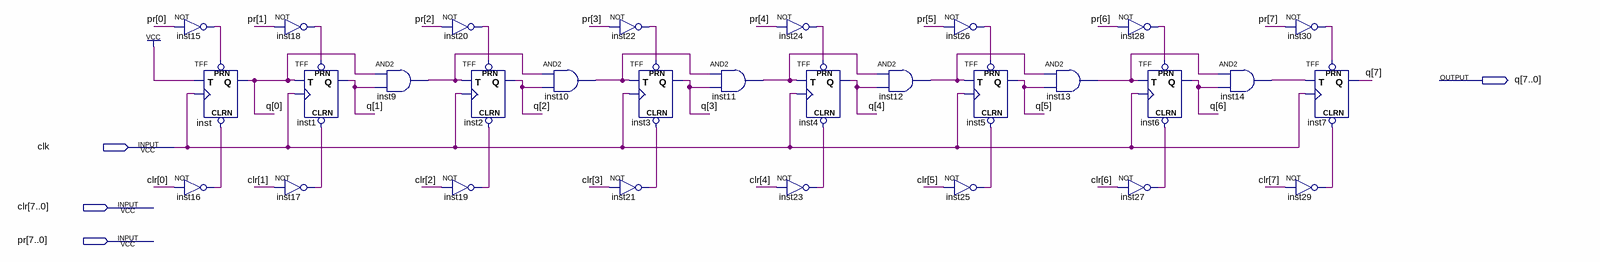
[diagram p0: schematic sheet]
// Quartus schematic contador.bdf as structural Verilog: 30 symbols, 4 pins
module contador (
  input  clk,
  input  [7:0] clr,
  input  [7:0] pr,
  output [7:0] q
);

  wire inst9_out, inst10_out, inst11_out, inst12_out, inst13_out, inst14_out, inst15_out, inst16_out,
       inst17_out, inst18_out, inst19_out, inst20_out, inst21_out, inst22_out, inst23_out, inst24_out,
       inst25_out, inst26_out, inst27_out, inst28_out, inst29_out, inst30_out;

  not inst15 (inst15_out, pr[0]);
  not inst16 (inst16_out, clr[0]);
  TFF inst (.PRN(inst15_out), .CLRN(inst16_out), .T(1'b1), .CLK(clk), .Q(q[0]));
  not inst18 (inst18_out, pr[1]);
  not inst17 (inst17_out, clr[1]);
  TFF inst1 (.PRN(inst18_out), .CLRN(inst17_out), .T(q[0]), .CLK(clk), .Q(q[1]));
  and inst9 (inst9_out, q[0], q[1]);
  not inst20 (inst20_out, pr[2]);
  not inst19 (inst19_out, clr[2]);
  TFF inst2 (.PRN(inst20_out), .CLRN(inst19_out), .T(inst9_out), .CLK(clk), .Q(q[2]));
  and inst10 (inst10_out, inst9_out, q[2]);
  not inst22 (inst22_out, pr[3]);
  TFF inst3 (.PRN(inst22_out), .CLRN(inst21_out), .T(inst10_out), .CLK(clk), .Q(q[3]));
  not inst21 (inst21_out, clr[3]);
  and inst11 (inst11_out, inst10_out, q[3]);
  not inst24 (inst24_out, pr[4]);
  TFF inst4 (.PRN(inst24_out), .CLRN(inst23_out), .T(inst11_out), .CLK(clk), .Q(q[4]));
  not inst23 (inst23_out, clr[4]);
  and inst12 (inst12_out, inst11_out, q[4]);
  not inst26 (inst26_out, pr[5]);
  TFF inst5 (.PRN(inst26_out), .CLRN(inst25_out), .T(inst12_out), .CLK(clk), .Q(q[5]));
  not inst25 (inst25_out, clr[5]);
  and inst13 (inst13_out, inst12_out, q[5]);
  not inst28 (inst28_out, pr[6]);
  TFF inst6 (.PRN(inst28_out), .CLRN(inst27_out), .T(inst13_out), .CLK(clk), .Q(q[6]));
  not inst27 (inst27_out, clr[6]);
  and inst14 (inst14_out, inst13_out, q[6]);
  not inst30 (inst30_out, pr[7]);
  not inst29 (inst29_out, clr[7]);
  TFF inst7 (.PRN(inst30_out), .CLRN(inst29_out), .T(inst14_out), .CLK(clk), .Q(q[7]));
endmodule
